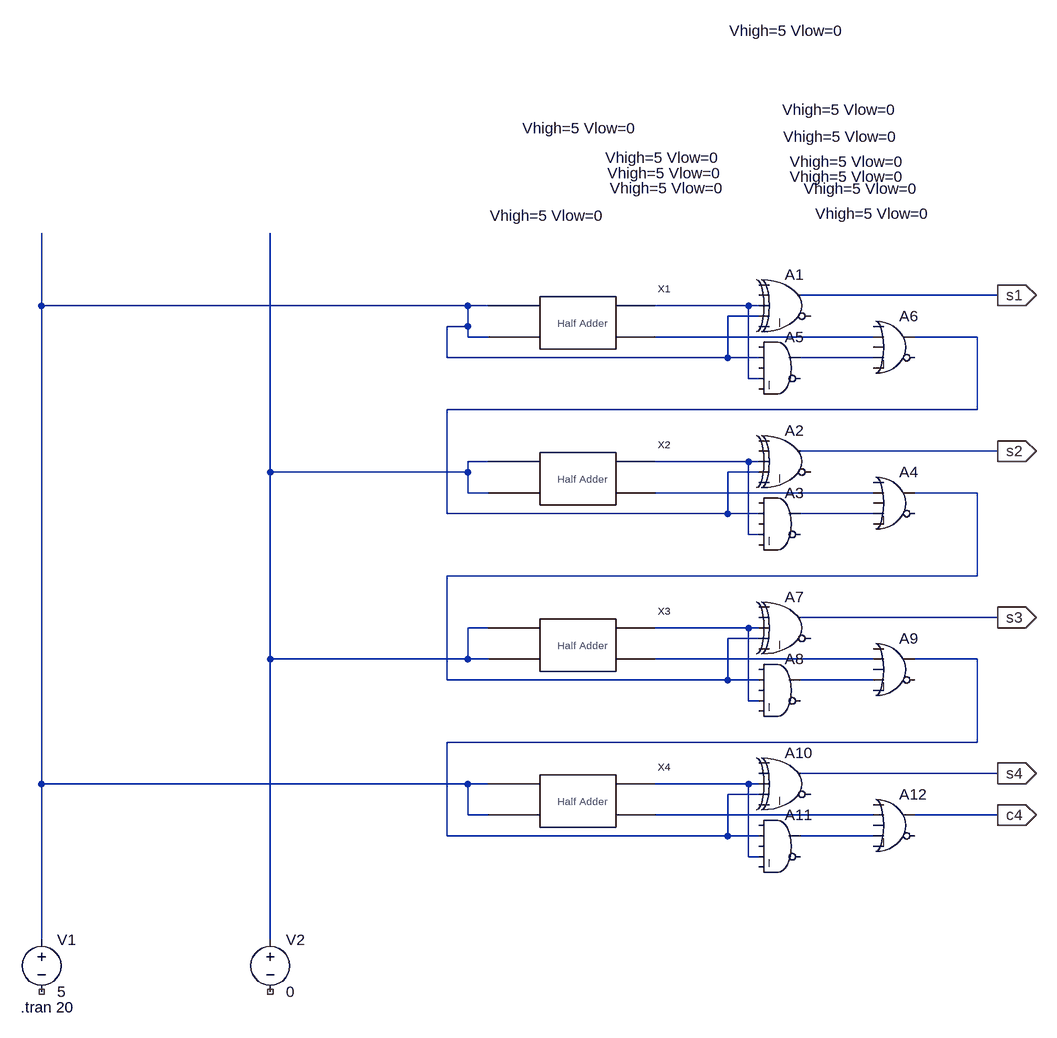
[diagram p0: schematic CarryLookAheadAdder.asc]
CarryLookAheadAdder.asc, the LTspice schematic file:
Version 4
SHEET 1 1000 1096
WIRE 912 -16 608 -16
WIRE -560 0 -560 -112
WIRE 96 0 -560 0
WIRE 128 0 96 0
WIRE 528 0 384 0
WIRE 544 0 528 0
WIRE 544 16 496 16
WIRE 96 32 96 0
WIRE 96 32 64 32
WIRE 96 48 96 32
WIRE 128 48 96 48
WIRE 720 48 384 48
WIRE 880 48 784 48
WIRE 64 80 64 32
WIRE 496 80 496 16
WIRE 496 80 64 80
WIRE 544 80 496 80
WIRE 720 80 608 80
WIRE 528 112 528 0
WIRE 544 112 528 112
WIRE 880 160 880 48
WIRE 880 160 64 160
WIRE 912 224 608 224
WIRE 128 240 96 240
WIRE 528 240 384 240
WIRE 544 240 528 240
WIRE -208 256 -208 -112
WIRE 96 256 96 240
WIRE 96 256 -208 256
WIRE 544 256 496 256
WIRE 96 288 96 256
WIRE 128 288 96 288
WIRE 720 288 384 288
WIRE 880 288 784 288
WIRE 64 320 64 160
WIRE 496 320 496 256
WIRE 496 320 64 320
WIRE 544 320 496 320
WIRE 720 320 608 320
WIRE 528 352 528 240
WIRE 544 352 528 352
WIRE 880 416 880 288
WIRE 880 416 64 416
WIRE 912 480 608 480
WIRE 128 496 96 496
WIRE 528 496 384 496
WIRE 544 496 528 496
WIRE 544 512 496 512
WIRE -208 544 -208 256
WIRE 96 544 96 496
WIRE 96 544 -208 544
WIRE 128 544 96 544
WIRE 720 544 384 544
WIRE 880 544 784 544
WIRE 64 576 64 416
WIRE 496 576 496 512
WIRE 496 576 64 576
WIRE 544 576 496 576
WIRE 720 576 608 576
WIRE 528 608 528 496
WIRE 544 608 528 608
WIRE 880 672 880 544
WIRE 880 672 64 672
WIRE 912 720 608 720
WIRE -560 736 -560 0
WIRE 96 736 -560 736
WIRE 128 736 96 736
WIRE 528 736 384 736
WIRE 544 736 528 736
WIRE 544 752 496 752
WIRE 96 784 96 736
WIRE 128 784 96 784
WIRE 720 784 384 784
WIRE 912 784 784 784
WIRE 64 816 64 672
WIRE 496 816 496 752
WIRE 496 816 64 816
WIRE 544 816 496 816
WIRE 720 816 608 816
WIRE 528 848 528 736
WIRE 544 848 528 848
WIRE -560 976 -560 736
WIRE -208 976 -208 544
FLAG 912 -16 s1
IOPIN 912 -16 Out
FLAG 912 224 s2
IOPIN 912 224 Out
FLAG 912 480 s3
IOPIN 912 480 Out
FLAG 912 784 c4
IOPIN 912 784 Out
FLAG 912 720 s4
IOPIN 912 720 Out
SYMBOL half_adder 272 32 R0
SYMATTR InstName X1
SYMBOL Digital\\xor 592 -64 R0
WINDOW 3 21 -116 Left 2
SYMATTR Value Vhigh=5 Vlow=0
SYMATTR InstName A1
SYMBOL Digital\\and 576 32 R0
WINDOW 3 55 -174 Left 2
SYMATTR Value Vhigh=5 Vlow=0
SYMATTR InstName A5
SYMBOL Digital\\or 752 0 R0
WINDOW 3 -160 -222 Left 2
SYMATTR Value Vhigh=5 Vlow=0
SYMATTR InstName A6
SYMBOL half_adder 272 272 R0
SYMATTR InstName X2
SYMBOL Digital\\xor 592 176 R0
WINDOW 3 -281 -380 Left 2
SYMATTR Value Vhigh=5 Vlow=0
SYMATTR InstName A2
SYMBOL Digital\\and 576 272 R0
WINDOW 3 -396 -545 Left 2
SYMATTR Value Vhigh=5 Vlow=0
SYMATTR InstName A3
SYMBOL Digital\\or 752 240 R0
WINDOW 3 -444 -468 Left 2
SYMATTR Value Vhigh=5 Vlow=0
SYMATTR InstName A4
SYMBOL half_adder 272 528 R0
SYMATTR InstName X3
SYMBOL Digital\\xor 592 432 R0
WINDOW 3 -462 -571 Left 2
SYMATTR Value Vhigh=5 Vlow=0
SYMATTR InstName A7
SYMBOL Digital\\and 576 528 R0
WINDOW 3 -261 -709 Left 2
SYMATTR Value Vhigh=5 Vlow=0
SYMATTR InstName A8
SYMBOL Digital\\or 752 496 R0
WINDOW 3 -160 -695 Left 2
SYMATTR Value Vhigh=5 Vlow=0
SYMATTR InstName A9
SYMBOL half_adder 272 768 R0
SYMATTR InstName X4
SYMBOL Digital\\xor 592 672 R0
WINDOW 3 -10 -932 Left 2
SYMATTR Value Vhigh=5 Vlow=0
SYMATTR InstName A10
SYMBOL Digital\\and 576 768 R0
WINDOW 3 -77 -1191 Left 2
SYMATTR Value Vhigh=5 Vlow=0
SYMATTR InstName A11
SYMBOL Digital\\or 752 736 R0
WINDOW 3 -172 -1038 Left 2
SYMATTR Value Vhigh=5 Vlow=0
SYMATTR InstName A12
SYMBOL voltage -560 960 R0
WINDOW 123 0 0 Left 0
WINDOW 39 0 0 Left 0
SYMATTR InstName V1
SYMATTR Value 5
SYMBOL voltage -208 960 R0
WINDOW 123 0 0 Left 0
WINDOW 39 0 0 Left 0
SYMATTR InstName V2
SYMATTR Value 0
TEXT -592 1080 Left 2 !.tran 20

The netlist it stands for:
* CarryLookAheadAdder.asc
XX1 N001 N001 N002 N003 half_adder  ; pins A B Sum carry
A1 0 0 N002 N001 0 0 s1 0 XOR Vhigh=5 Vlow=0
A5 0 N001 0 N002 0 0 N005 0 AND Vhigh=5 Vlow=0
A6 0 N003 0 N005 0 0 N004 0 OR Vhigh=5 Vlow=0
XX2 N006 N006 N007 N008 half_adder  ; pins A B Sum carry
A2 0 0 N007 N004 0 0 s2 0 XOR Vhigh=5 Vlow=0
A3 0 N004 0 N007 0 0 N010 0 AND Vhigh=5 Vlow=0
A4 0 N008 0 N010 0 0 N009 0 OR Vhigh=5 Vlow=0
XX3 N006 N006 N011 N012 half_adder  ; pins A B Sum carry
A7 0 0 N011 N009 0 0 s3 0 XOR Vhigh=5 Vlow=0
A8 0 N009 0 N011 0 0 N014 0 AND Vhigh=5 Vlow=0
A9 0 N012 0 N014 0 0 N013 0 OR Vhigh=5 Vlow=0
XX4 N001 N001 N015 N016 half_adder  ; pins A B Sum carry
A10 0 0 N015 N013 0 0 s4 0 XOR Vhigh=5 Vlow=0
A11 0 N013 0 N015 0 0 N017 0 AND Vhigh=5 Vlow=0
A12 0 N016 0 N017 0 0 c4 0 OR Vhigh=5 Vlow=0
V1 N001 NC_01 5
V2 N006 NC_02 0
.tran 20
.backanno
.end